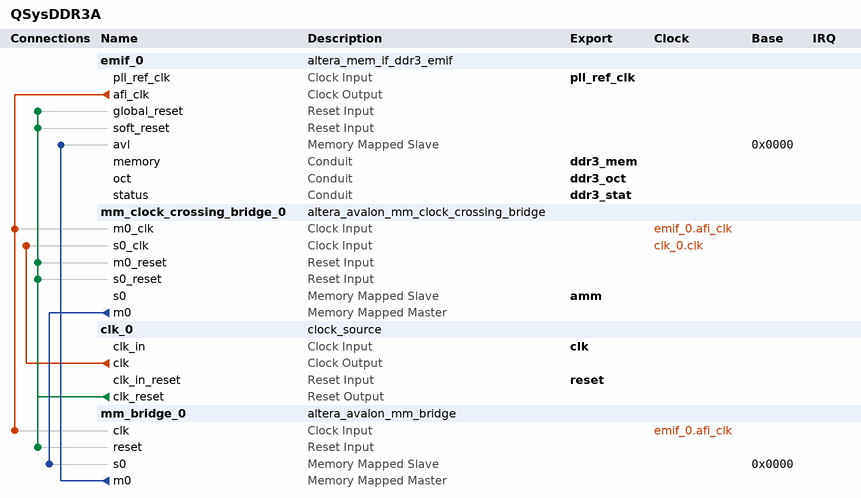
[diagram p0: system contents]
# Platform Designer (Qsys) system QSysDDR3A, Stratix V 5SGXEA7N2F45C2
# Parameters at their usual value, and those the tool derives, are not listed.
package require -exact qsys 17.0
create_system QSysDDR3A
set_project_property DEVICE_FAMILY {Stratix V}
set_project_property DEVICE 5SGXEA7N2F45C2

add_instance emif_0 altera_mem_if_ddr3_emif 17.0
set_instance_parameter_value emif_0 AVL_MAX_SIZE 4
set_instance_parameter_value emif_0 CALIBRATION_MODE Skip
set_instance_parameter_value emif_0 CPORT_TYPE_PORT Bidirectional,Bidirectional,Bidirectional,Bidirectional,Bidirectional,Bidirectional
set_instance_parameter_value emif_0 EXPORT_AFI_HALF_CLK false
set_instance_parameter_value emif_0 HARD_EMIF false
set_instance_parameter_value emif_0 MEM_BANKADDR_WIDTH 3
set_instance_parameter_value emif_0 MEM_CLK_FREQ 800.0
set_instance_parameter_value emif_0 MEM_CLK_FREQ_MAX 800.0
set_instance_parameter_value emif_0 MEM_COL_ADDR_WIDTH 10
set_instance_parameter_value emif_0 MEM_DQ_WIDTH 64
set_instance_parameter_value emif_0 MEM_FORMAT UNBUFFERED
set_instance_parameter_value emif_0 MEM_ROW_ADDR_WIDTH 15
set_instance_parameter_value emif_0 MEM_TCL 11
set_instance_parameter_value emif_0 MEM_TFAW_NS 30.0
set_instance_parameter_value emif_0 MEM_TRAS_NS 35.0
set_instance_parameter_value emif_0 MEM_TRCD_NS 13.75
set_instance_parameter_value emif_0 MEM_TRFC_NS 160.0
set_instance_parameter_value emif_0 MEM_TRP_NS 13.75
set_instance_parameter_value emif_0 MEM_TRRD_NS 6.0
set_instance_parameter_value emif_0 MEM_TRTP_NS 7.5
set_instance_parameter_value emif_0 MEM_TWTR 6
set_instance_parameter_value emif_0 MEM_VENDOR JEDEC
set_instance_parameter_value emif_0 MEM_WTCL 8
set_instance_parameter_value emif_0 PLL_LOCATION Top_Bottom
set_instance_parameter_value emif_0 POWER_OF_TWO_BUS true
set_instance_parameter_value emif_0 PRIORITY_PORT 1,1,1,1,1,1
set_instance_parameter_value emif_0 RATE Quarter
set_instance_parameter_value emif_0 REF_CLK_FREQ 50.0
set_instance_parameter_value emif_0 SPEED_GRADE 2
set_instance_parameter_value emif_0 TIMING_BOARD_AC_SKEW 0.05
set_instance_parameter_value emif_0 TIMING_BOARD_AC_TO_CK_SKEW 0.012
set_instance_parameter_value emif_0 TIMING_BOARD_DQ_TO_DQS_SKEW 0.002
set_instance_parameter_value emif_0 TIMING_BOARD_MAX_CK_DELAY 1.33
set_instance_parameter_value emif_0 TIMING_BOARD_MAX_DQS_DELAY 0.61
set_instance_parameter_value emif_0 TIMING_BOARD_SKEW_BETWEEN_DQS 0.09
set_instance_parameter_value emif_0 TIMING_BOARD_SKEW_CKDQS_DIMM_MAX 0.0
set_instance_parameter_value emif_0 TIMING_BOARD_SKEW_CKDQS_DIMM_MIN 0.0
set_instance_parameter_value emif_0 TIMING_BOARD_SKEW_WITHIN_DQS 0.007
set_instance_parameter_value emif_0 TIMING_TDH 45
set_instance_parameter_value emif_0 TIMING_TDQSCK 225
set_instance_parameter_value emif_0 TIMING_TDQSQ 100
set_instance_parameter_value emif_0 TIMING_TDQSS 0.25
set_instance_parameter_value emif_0 TIMING_TDS 10
set_instance_parameter_value emif_0 TIMING_TDSH 0.18
set_instance_parameter_value emif_0 TIMING_TDSS 0.18
set_instance_parameter_value emif_0 TIMING_TIH 120
set_instance_parameter_value emif_0 TIMING_TIS 170
set_instance_parameter_value emif_0 TIMING_TQSH 0.4
set_instance_parameter_value emif_0 USER_DEBUG_LEVEL 1

add_instance mm_clock_crossing_bridge_0 altera_avalon_mm_clock_crossing_bridge 17.0
set_instance_parameter_value mm_clock_crossing_bridge_0 ADDRESS_UNITS WORDS
set_instance_parameter_value mm_clock_crossing_bridge_0 ADDRESS_WIDTH 10
set_instance_parameter_value mm_clock_crossing_bridge_0 COMMAND_FIFO_DEPTH 8
set_instance_parameter_value mm_clock_crossing_bridge_0 DATA_WIDTH 128
set_instance_parameter_value mm_clock_crossing_bridge_0 MASTER_SYNC_DEPTH 2
set_instance_parameter_value mm_clock_crossing_bridge_0 MAX_BURST_SIZE 8
set_instance_parameter_value mm_clock_crossing_bridge_0 RESPONSE_FIFO_DEPTH 32
set_instance_parameter_value mm_clock_crossing_bridge_0 SLAVE_SYNC_DEPTH 2
set_instance_parameter_value mm_clock_crossing_bridge_0 USE_AUTO_ADDRESS_WIDTH 1

add_instance clk_0 clock_source 17.0
set_instance_parameter_value clk_0 clockFrequency 125000000

add_instance mm_bridge_0 altera_avalon_mm_bridge 17.0
set_instance_parameter_value mm_bridge_0 ADDRESS_UNITS WORDS
set_instance_parameter_value mm_bridge_0 ADDRESS_WIDTH 10
set_instance_parameter_value mm_bridge_0 DATA_WIDTH 128
set_instance_parameter_value mm_bridge_0 MAX_PENDING_RESPONSES 2
set_instance_parameter_value mm_bridge_0 USE_AUTO_ADDRESS_WIDTH 1

# connections
add_connection clk_0.clk mm_clock_crossing_bridge_0.s0_clk clock
add_connection emif_0.afi_clk mm_bridge_0.clk clock
add_connection emif_0.afi_clk mm_clock_crossing_bridge_0.m0_clk clock
add_connection clk_0.clk_reset emif_0.global_reset reset
add_connection clk_0.clk_reset emif_0.soft_reset reset
add_connection clk_0.clk_reset mm_bridge_0.reset reset
add_connection clk_0.clk_reset mm_clock_crossing_bridge_0.m0_reset reset
add_connection clk_0.clk_reset mm_clock_crossing_bridge_0.s0_reset reset
add_connection mm_bridge_0.m0 emif_0.avl avalon
set_connection_parameter_value mm_bridge_0.m0/emif_0.avl baseAddress 0x0000
add_connection mm_clock_crossing_bridge_0.m0 mm_bridge_0.s0 avalon
set_connection_parameter_value mm_clock_crossing_bridge_0.m0/mm_bridge_0.s0 baseAddress 0x0000

# exported interfaces
add_interface amm avalon slave
set_interface_property amm EXPORT_OF mm_clock_crossing_bridge_0.s0
add_interface clk clock sink
set_interface_property clk EXPORT_OF clk_0.clk_in
add_interface ddr3_mem conduit end
set_interface_property ddr3_mem EXPORT_OF emif_0.memory
add_interface ddr3_oct conduit end
set_interface_property ddr3_oct EXPORT_OF emif_0.oct
add_interface ddr3_stat conduit end
set_interface_property ddr3_stat EXPORT_OF emif_0.status
add_interface pll_ref_clk clock sink
set_interface_property pll_ref_clk EXPORT_OF emif_0.pll_ref_clk
add_interface reset reset sink
set_interface_property reset EXPORT_OF clk_0.clk_in_reset

set_interconnect_requirement {$system} qsys_mm.clockCrossingAdapter HANDSHAKE
set_interconnect_requirement {$system} qsys_mm.enableEccProtection FALSE
set_interconnect_requirement {$system} qsys_mm.insertDefaultSlave FALSE
set_interconnect_requirement {$system} qsys_mm.maxAdditionalLatency 1

save_system QSysDDR3A.qsys
